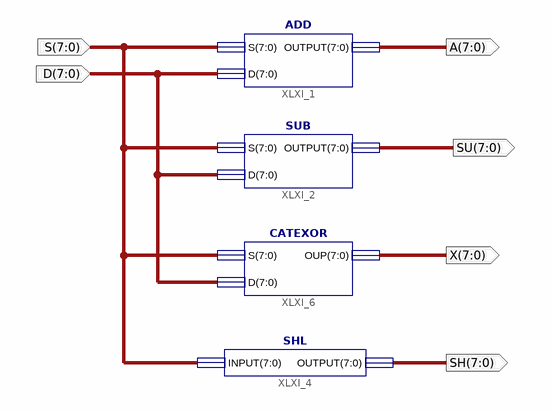
[diagram p0: schematic sheet 1]
// Xilinx ISE schematic OPERATER.sch (spartan6) as structural Verilog: 4 symbols, 6 ports
module OPERATER (
  input  [7:0] S,
  input  [7:0] D,
  output [7:0] A,
  output [7:0] SU,
  output [7:0] X,
  output [7:0] SH
);

  ADD XLXI_1 (.D(D), .OUTPUT(A), .S(S));
  SUB XLXI_2 (.D(D), .OUTPUT(SU), .S(S));
  SHL XLXI_4 (.INPUT(S), .OUTPUT(SH));
  CATEXOR XLXI_6 (.D(D), .OUP(X), .S(S));
endmodule
